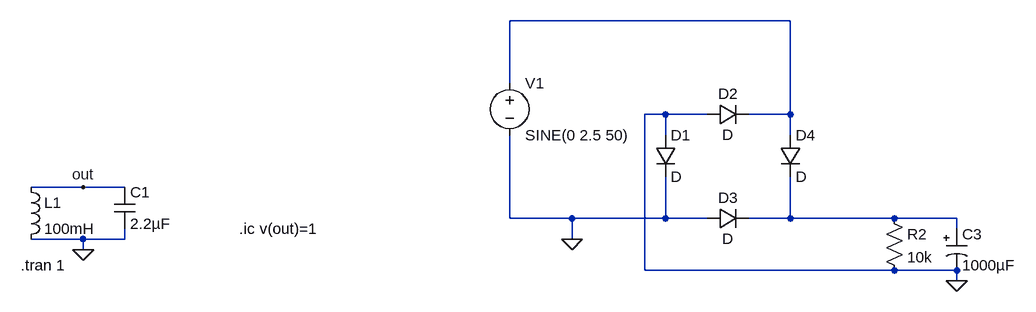
[diagram p0: schematic Draft1.asc]
Draft1.asc, the LTspice schematic file:
Version 4.1
SHEET 1 1528 680
WIRE 992 -208 560 -208
WIRE 560 -112 560 -208
WIRE 800 -64 768 -64
WIRE 864 -64 800 -64
WIRE 992 -64 992 -208
WIRE 992 -64 928 -64
WIRE 800 -32 800 -64
WIRE 992 -32 992 -64
WIRE -96 48 -176 48
WIRE -32 48 -96 48
WIRE 560 96 560 -32
WIRE 656 96 560 96
WIRE 800 96 800 32
WIRE 800 96 656 96
WIRE 864 96 800 96
WIRE 992 96 992 32
WIRE 992 96 928 96
WIRE 1152 96 992 96
WIRE 1248 96 1152 96
WIRE 1248 112 1248 96
WIRE -96 128 -176 128
WIRE -32 128 -32 112
WIRE -32 128 -96 128
WIRE 656 128 656 96
WIRE -96 144 -96 128
WIRE 768 176 768 -64
WIRE 1152 176 768 176
WIRE 1248 176 1152 176
WIRE 1248 192 1248 176
FLAG -96 144 0
FLAG -96 48 out
FLAG 656 128 0
FLAG 1248 192 0
SYMBOL ind -192 32 R0
SYMATTR InstName L1
SYMATTR Value 100mH
SYMBOL cap -48 48 R0
SYMATTR InstName C1
SYMATTR Value 2.2µF
SYMBOL diode 784 -32 R0
SYMATTR InstName D1
SYMBOL diode 864 -48 R270
WINDOW 0 32 32 VTop 2
WINDOW 3 0 32 VBottom 2
SYMATTR InstName D2
SYMBOL diode 864 112 R270
WINDOW 0 32 32 VTop 2
WINDOW 3 0 32 VBottom 2
SYMATTR InstName D3
SYMBOL diode 976 -32 R0
SYMATTR InstName D4
SYMBOL voltage 560 -128 R0
WINDOW 123 0 0 Left 0
WINDOW 39 0 0 Left 0
SYMATTR InstName V1
SYMATTR Value SINE(0 2.5 50)
SYMBOL res 1136 80 R0
SYMATTR InstName R2
SYMATTR Value 10k
SYMBOL polcap 1232 112 R0
SYMATTR InstName C3
SYMATTR Value 1000µF
TEXT -192 168 Left 2 !.tran 1
TEXT 144 112 Left 2 !.ic v(out)=1

The netlist it stands for:
* Draft1.asc
L1 out 0 100mH
C1 out 0 2.2µF
D1 0 0 D
D2 0 N001 D
D3 0 N002 D
D4 N001 N002 D
V1 N001 0 SINE(0 2.5 50)
R2 N002 0 10k
C3 N002 0 1000µF
.model D D
.lib standard.dio
.tran 1
.ic v(out)=1
.backanno
.end